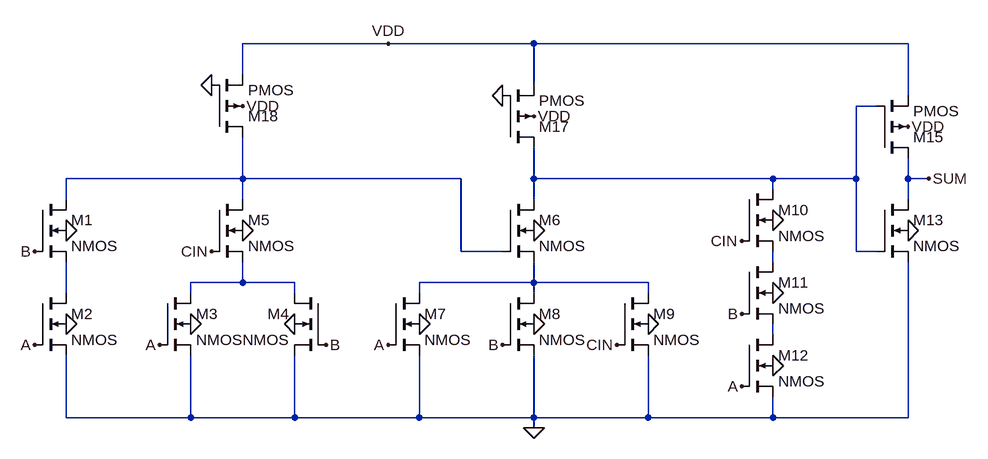
[diagram p0: schematic FA_pseudo_2.asc]
FA_pseudo_2.asc, the LTspice schematic file:
Version 4
SHEET 1 1200 680
WIRE 16 -64 -208 -64
WIRE 240 -64 16 -64
WIRE 816 -64 240 -64
WIRE -208 -16 -208 -64
WIRE 240 0 240 -64
WIRE 816 16 816 -64
WIRE 768 32 736 32
WIRE -208 144 -208 80
WIRE -208 144 -480 144
WIRE 128 144 -208 144
WIRE 240 144 240 96
WIRE 608 144 240 144
WIRE 736 144 736 32
WIRE 736 144 608 144
WIRE 816 144 816 112
WIRE 848 144 816 144
WIRE 608 160 608 144
WIRE -480 176 -480 144
WIRE -208 176 -208 144
WIRE 240 176 240 144
WIRE 816 176 816 144
WIRE 128 256 128 144
WIRE 192 256 128 256
WIRE 736 256 736 144
WIRE 768 256 736 256
WIRE 608 272 608 256
WIRE -208 304 -208 272
WIRE -208 304 -288 304
WIRE -128 304 -208 304
WIRE 240 304 240 272
WIRE 240 304 64 304
WIRE 416 304 240 304
WIRE -480 320 -480 272
WIRE -288 320 -288 304
WIRE -128 320 -128 304
WIRE 64 320 64 304
WIRE 240 320 240 304
WIRE 416 320 416 304
WIRE 608 384 608 368
WIRE -480 512 -480 416
WIRE -288 512 -288 416
WIRE -288 512 -480 512
WIRE -128 512 -128 416
WIRE -128 512 -288 512
WIRE 64 512 64 416
WIRE 64 512 -128 512
WIRE 240 512 240 416
WIRE 240 512 64 512
WIRE 416 512 416 416
WIRE 416 512 240 512
WIRE 608 512 608 480
WIRE 608 512 416 512
WIRE 816 512 816 272
WIRE 816 512 608 512
WIRE 240 528 240 512
FLAG -528 400 A
FLAG -336 400 A
FLAG 16 400 A
FLAG 560 464 A
FLAG -528 256 B
FLAG -80 400 B
FLAG 192 400 B
FLAG 560 352 B
FLAG -256 256 CIN
FLAG 368 400 CIN
FLAG 560 240 CIN
FLAG -480 368 0
FLAG -480 224 0
FLAG -208 224 0
FLAG -288 368 0
FLAG -128 368 0
FLAG 64 368 0
FLAG 240 224 0
FLAG 416 368 0
FLAG 240 368 0
FLAG 608 432 0
FLAG 608 320 0
FLAG 608 208 0
FLAG 816 224 0
FLAG 816 64 VDD
FLAG 848 144 SUM
FLAG 240 528 0
FLAG 192 16 0
FLAG -256 0 0
FLAG 16 -64 VDD
FLAG -208 32 VDD
FLAG 240 48 VDD
SYMBOL nmos4 -528 176 R0
SYMATTR InstName M1
SYMBOL nmos4 -528 320 R0
SYMATTR InstName M2
SYMBOL nmos4 -336 320 R0
SYMATTR InstName M3
SYMBOL nmos4 -80 320 M0
SYMATTR InstName M4
SYMBOL nmos4 -256 176 R0
SYMATTR InstName M5
SYMBOL nmos4 192 176 R0
SYMATTR InstName M6
SYMBOL nmos4 16 320 R0
SYMATTR InstName M7
SYMBOL nmos4 192 320 R0
SYMATTR InstName M8
SYMBOL nmos4 368 320 R0
SYMATTR InstName M9
SYMBOL nmos4 560 160 R0
SYMATTR InstName M10
SYMBOL nmos4 560 272 R0
SYMATTR InstName M11
SYMBOL nmos4 560 384 R0
SYMATTR InstName M12
SYMBOL nmos4 768 176 R0
SYMATTR InstName M13
SYMBOL pmos4 768 112 M180
SYMATTR InstName M15
SYMBOL pmos4 192 96 M180
SYMATTR InstName M17
SYMBOL pmos4 -256 80 M180
SYMATTR InstName M18

The netlist it stands for:
* FA_pseudo_2.asc
M1 N002 B N006 0 NMOS
M2 N006 A 0 0 NMOS
M3 N004 A 0 0 NMOS
M4 N004 B 0 0 NMOS
M5 N002 CIN N004 0 NMOS
M6 N001 N002 N005 0 NMOS
M7 N005 A 0 0 NMOS
M8 N005 B 0 0 NMOS
M9 N005 CIN 0 0 NMOS
M10 N001 CIN N003 0 NMOS
M11 N003 B N007 0 NMOS
M12 N007 A 0 0 NMOS
M13 SUM N001 0 0 NMOS
M15 SUM N001 VDD VDD PMOS
M17 N001 0 VDD VDD PMOS
M18 N002 0 VDD VDD PMOS
.model NMOS NMOS
.model PMOS PMOS
.lib standard.mos
.backanno
.end